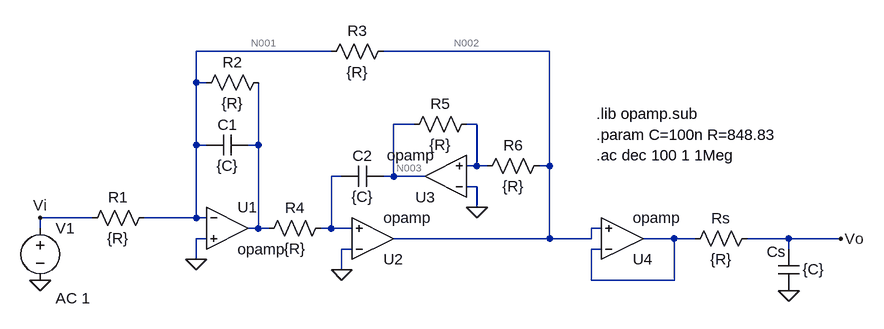
[diagram p0: schematic TPS3_5.asc]
TPS3_5.asc, the LTspice schematic file:
Version 4
SHEET 1 1120 680
WIRE 288 0 80 0
WIRE 624 0 368 0
WIRE 80 48 80 0
WIRE 96 48 80 48
WIRE 416 112 384 112
WIRE 512 112 496 112
WIRE 80 144 80 48
WIRE 96 144 80 144
WIRE 176 144 176 48
WIRE 176 144 160 144
WIRE 512 176 512 112
WIRE 512 176 496 176
WIRE 528 176 512 176
WIRE 624 176 624 0
WIRE 624 176 608 176
WIRE 304 192 288 192
WIRE 384 192 384 112
WIRE 384 192 368 192
WIRE 432 192 384 192
WIRE 512 208 496 208
WIRE 512 240 512 208
WIRE -80 256 -160 256
WIRE 80 256 80 144
WIRE 80 256 0 256
WIRE 96 256 80 256
WIRE -160 272 -160 256
WIRE 176 272 176 144
WIRE 176 272 160 272
WIRE 192 272 176 272
WIRE 288 272 288 192
WIRE 288 272 272 272
WIRE 320 272 288 272
WIRE 704 272 688 272
WIRE 96 288 80 288
WIRE 624 288 624 176
WIRE 624 288 384 288
WIRE 688 288 688 272
WIRE 688 288 624 288
WIRE 816 288 768 288
WIRE 848 288 816 288
WIRE 992 288 928 288
WIRE 1072 288 992 288
WIRE 320 304 304 304
WIRE 704 304 688 304
WIRE 992 304 992 288
WIRE 80 320 80 288
WIRE 304 336 304 304
WIRE 688 352 688 304
WIRE 816 352 816 288
WIRE 816 352 688 352
FLAG 80 320 0
FLAG -160 352 0
FLAG 304 336 0
FLAG 512 240 0
FLAG -160 256 Vi
FLAG 992 368 0
FLAG 1072 288 Vo
SYMBOL res 16 240 R90
WINDOW 0 0 56 VBottom 2
WINDOW 3 32 56 VTop 2
SYMATTR InstName R1
SYMATTR Value {R}
SYMBOL res 192 32 R90
WINDOW 0 0 56 VBottom 2
WINDOW 3 32 56 VTop 2
SYMATTR InstName R2
SYMATTR Value {R}
SYMBOL cap 160 128 R90
WINDOW 0 0 32 VBottom 2
WINDOW 3 32 32 VTop 2
SYMATTR InstName C1
SYMATTR Value {C}
SYMBOL OpAmps\\opamp 128 208 R0
SYMATTR InstName U1
SYMBOL res 288 256 R90
WINDOW 0 0 56 VBottom 2
WINDOW 3 32 56 VTop 2
SYMATTR InstName R4
SYMATTR Value {R}
SYMBOL voltage -160 256 R0
WINDOW 123 24 124 Left 2
WINDOW 39 0 0 Left 0
SYMATTR Value2 AC 1
SYMATTR InstName V1
SYMATTR Value ""
SYMBOL res 384 -16 R90
WINDOW 0 0 56 VBottom 2
WINDOW 3 32 56 VTop 2
SYMATTR InstName R3
SYMATTR Value {R}
SYMBOL OpAmps\\opamp 352 352 M180
SYMATTR InstName U2
SYMBOL cap 368 176 R90
WINDOW 0 0 32 VBottom 2
WINDOW 3 32 32 VTop 2
SYMATTR InstName C2
SYMATTR Value {C}
SYMBOL OpAmps\\opamp 464 256 R180
SYMATTR InstName U3
SYMBOL res 624 160 R90
WINDOW 0 0 56 VBottom 2
WINDOW 3 32 56 VTop 2
SYMATTR InstName R6
SYMATTR Value {R}
SYMBOL res 512 96 R90
WINDOW 0 0 56 VBottom 2
WINDOW 3 32 56 VTop 2
SYMATTR InstName R5
SYMATTR Value {R}
SYMBOL OpAmps\\opamp 736 352 M180
SYMATTR InstName U4
SYMBOL res 944 272 R90
WINDOW 0 0 56 VBottom 2
WINDOW 3 32 56 VTop 2
SYMATTR InstName Rs
SYMATTR Value {R}
SYMBOL cap 976 304 R0
WINDOW 0 -18 4 Left 2
WINDOW 3 38 31 Left 2
SYMATTR InstName Cs
SYMATTR Value {C}
TEXT 696 96 Left 2 !.lib opamp.sub
TEXT 696 160 Left 2 !.ac dec 100 1 1Meg
TEXT 696 128 Left 2 !.param C=100n R=848.83

The netlist it stands for:
* TPS3_5.asc
R1 N001 Vi {R}
R2 N005 N001 {R}
C1 N005 N001 {C}
XU1 N001 0 N005 opamp Aol=100K GBW=10Meg  ; pins invin noninvin out
R4 N006 N005 {R}
V1 Vi 0 AC 1
R3 N002 N001 {R}
XU2 0 N006 N002 opamp Aol=100K GBW=10Meg  ; pins invin noninvin out
C2 N003 N006 {C}
XU3 0 N004 N003 opamp Aol=100K GBW=10Meg  ; pins invin noninvin out
R6 N002 N004 {R}
R5 N004 N003 {R}
XU4 N007 N002 N007 opamp Aol=100K GBW=10Meg  ; pins invin noninvin out
Rs Vo N007 {R}
Cs Vo 0 {C}
.lib opamp.sub
.ac dec 100 1 1Meg
.param C=100n R=848.83
.backanno
.end

* Results of the author's LTspice run, read from the files saved beside the schematic
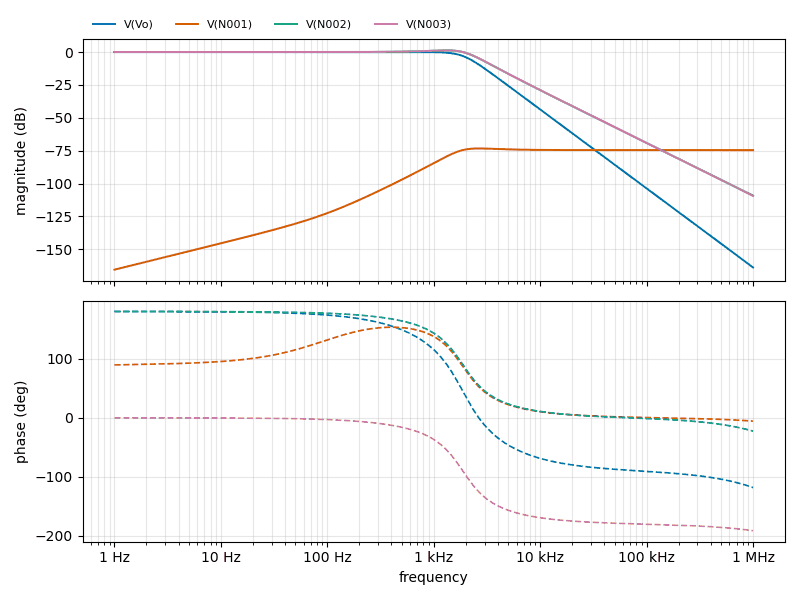
[diagram p1: AC Analysis of TPS3_5.asc, plotted from the saved traces]
* AC Analysis, 1 run:
*   V(Vo): -0.00 dB at 1 Hz, -163.75 dB at 1 MHz, peak 0.00 dB at 309 Hz, 3 dB below the peak at 1.875 kHz
*   V(N001): -165.44 dB at 1 Hz, -74.59 dB at 1 MHz, peak -73.28 dB at 2.63 kHz, 3 dB below the peak at 1.603 kHz
*   V(N002): -0.00 dB at 1 Hz, -109.17 dB at 1 MHz, peak 1.25 dB at 1.318 kHz, 3 dB below the peak at 2.191 kHz
*   V(N003): 0.00 dB at 1 Hz, -109.34 dB at 1 MHz, peak 1.25 dB at 1.318 kHz, 3 dB below the peak at 2.191 kHz